# Altium schematic sheet Arak-SlaveMux.SchDoc
size A4
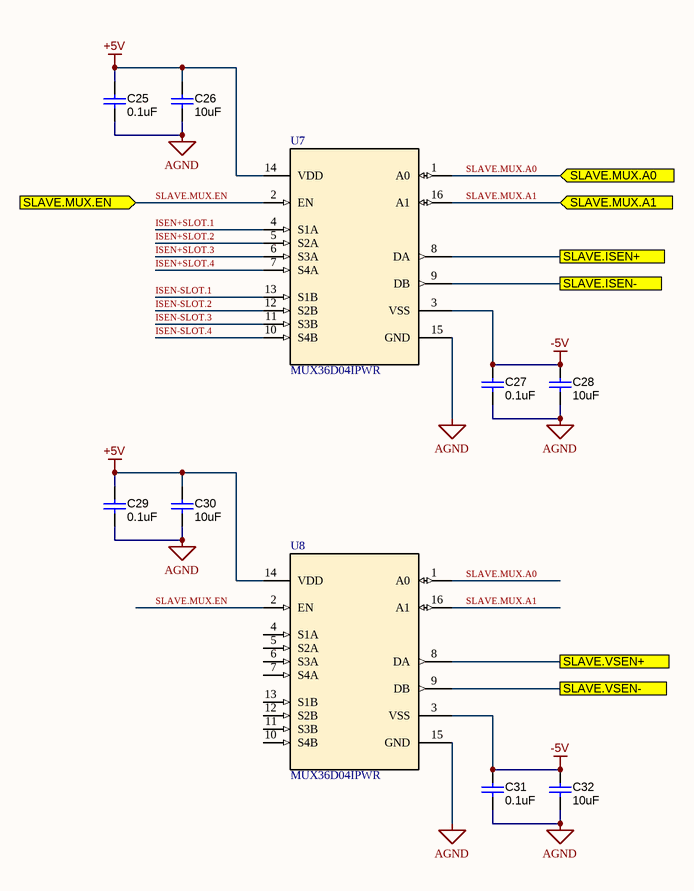
[diagram p0: Arak-SlaveMux.SchDoc]

## Parts
C25  ValueDisplayed: 0.1uF  [0603]  (hidden comment: Capacitor)
C26  ValueDisplayed: 10uF  [0805_HV]  (hidden comment: Capacitor)
C27  ValueDisplayed: 0.1uF  [0603]  (hidden comment: Capacitor)
C28  ValueDisplayed: 10uF  [0805_HV]  (hidden comment: Capacitor)
C29  ValueDisplayed: 0.1uF  [0603]  (hidden comment: Capacitor)
C30  ValueDisplayed: 10uF  [0805_HV]  (hidden comment: Capacitor)
C31  ValueDisplayed: 0.1uF  [0603]  (hidden comment: Capacitor)
C32  ValueDisplayed: 10uF  [0805_HV]  (hidden comment: Capacitor)
U7  MUX36D04IPWR  [PW0016A_N]
U8  MUX36D04IPWR  [PW0016A_N]

## Ports
SLAVE.ISEN+, SLAVE.ISEN-, SLAVE.MUX.A0 (in), SLAVE.MUX.A1 (in), SLAVE.MUX.EN (in), SLAVE.VSEN+, SLAVE.VSEN-

## Nets
+5V: C25.1 C26.1 C29.1 C30.1 U7.14(VDD) U8.14(VDD)
-5V: C27.1 C28.1 C31.1 C32.1 U7.3(VSS) U8.3(VSS)
AGND: C25.2 C26.2 C27.2 C28.2 C29.2 C30.2 C31.2 C32.2 U7.15(GND) U8.15(GND)
ISEN+SLOT.1: U7.4(S1A)
ISEN+SLOT.2: U7.5(S2A)
ISEN+SLOT.3: U7.6(S3A)
ISEN+SLOT.4: U7.7(S4A)
ISEN-SLOT.1: U7.13(S1B)
ISEN-SLOT.2: U7.12(S2B)
ISEN-SLOT.3: U7.11(S3B)
ISEN-SLOT.4: U7.10(S4B)
SLAVE.ISEN+: U7.8(DA) ; port SLAVE.ISEN+
SLAVE.ISEN-: U7.9(DB) ; port SLAVE.ISEN-
SLAVE.MUX.A0: U7.1(A0) U8.1(A0) ; port SLAVE.MUX.A0
SLAVE.MUX.A1: U7.16(A1) U8.16(A1) ; port SLAVE.MUX.A1
SLAVE.MUX.EN: U7.2(EN) U8.2(EN) ; port SLAVE.MUX.EN
SLAVE.VSEN+: U8.8(DA) ; port SLAVE.VSEN+
SLAVE.VSEN-: U8.9(DB) ; port SLAVE.VSEN-

Not connected (* = marked no-connect by the designer): U8 4(S1A) 5(S2A) 6(S3A) 7(S4A) 10(S4B) 11(S3B) 12(S2B) 13(S1B)

## Library data of the parts
C25 C27 C29 C31 = CMP-0006752-5: CAP, CERM, 0.1 uF, 25 V, +/- 5%, X7R, 0603; PartNumber: 06033C104JAT2A; Manufacturer: AVX; Polarized: N; Value: 0.1uF; U/M: EA; Cap_F: 100nF; ESR_ohm: 0.05; Value1: 0.05 ohm; VDC_V: 25V; TaMin_C: -55°C; TaMax_C: 125°C; AEC Category: Q200; SizeArea_mm2: 1.28; SizeAreaWB_mm2: 4.68; SizeX_mm: 1.6; SizeY_mm: 0.8; SizeZ_mm: 1; CompType: Capacitor; PackageReference: 0603; RoHS: Y; Tolerance_%: 5%; Value2: 25V; MountType: SMT; Technology: Ceramic; TempCo: X7R; Cap_Case: 0603; Published: 2008-06-19; Publisher: Texas Instruments; LatestRevisionDate: 2017-03-09; ComponentLink1Description: Datasheet link; ComponentLink1URL: http://datasheets.avx.com/X7RDielectric.pdf; Supplier 1: Digi-Key; Supplier Part Number 1: 478-3713-1-ND; Supplier 2: Mouser; Supplier Part Number 2: 581-06033C104JAT2A; Supplier 3: Farnell; Supplier Part Number 3: 1740614; AEC Qualified: N; AEC Grade: N/A
C26 C28 C30 C32 = CMP-0008315-2: CAP, CERM, 10 uF, 10 V, +/- 10%, X7R, 0805; PartNumber: GRM21BR71A106KE51L; Manufacturer: MuRata; Polarized: N; Value: 10uF; U/M: EA; Cap_F: 10µF; ESR_ohm: 3m; Value1: 0.003 ohm; VDC_V: 10V; TaMin_C: -55°C; TaMax_C: 125°C; Cap_Case: 0805; AEC Category: Q200; SizeArea_mm2: 2.5; SizeAreaWB_mm2: 6.75; SizeX_mm: 2; SizeY_mm: 1.25; SizeZ_mm: 1.45; CompType: Capacitor; PackageReference: 0805; RoHS: Y; Tolerance_%: 10%; Value2: 10V; MountType: SMT; Technology: Ceramic; TempCo: X7R; Published: 2008-06-19; Publisher: Texas Instruments; LatestRevisionDate: 2017-03-09; ComponentLink1Description: Datasheet link; ComponentLink1URL: http://search.murata.co.jp/Ceramy/PnsearchViewAction.do?HnOFG=ON&HnNFG=ON&SEL_CNT=50&sLang=en&sKey=GRM21BR71A106KE51L&x=9&y=9&search=startwith; Supplier 1: Digi-Key; Supplier Part Number 1: 490-3905-1-ND; Supplier 2: Mouser; Supplier Part Number 2: 81-GRM21BR71A106KE51; Supplier 3: Farnell; Supplier Part Number 3: 1828828; AEC Qualified: ?
U7 U8 = MUX36D04IPWR: No Description Available; Manufacturer: Texas Instruments; PartNumber: MUX36D04IPWR; RefDes: RefDes; Type: DEV; Value: Value; Copyright: Copyright (C) 2018 Accelerated Designs. All rights reserved